# EAGLE design filters_V1.1_no_gnd_vias (EAGLE 7.4.0)
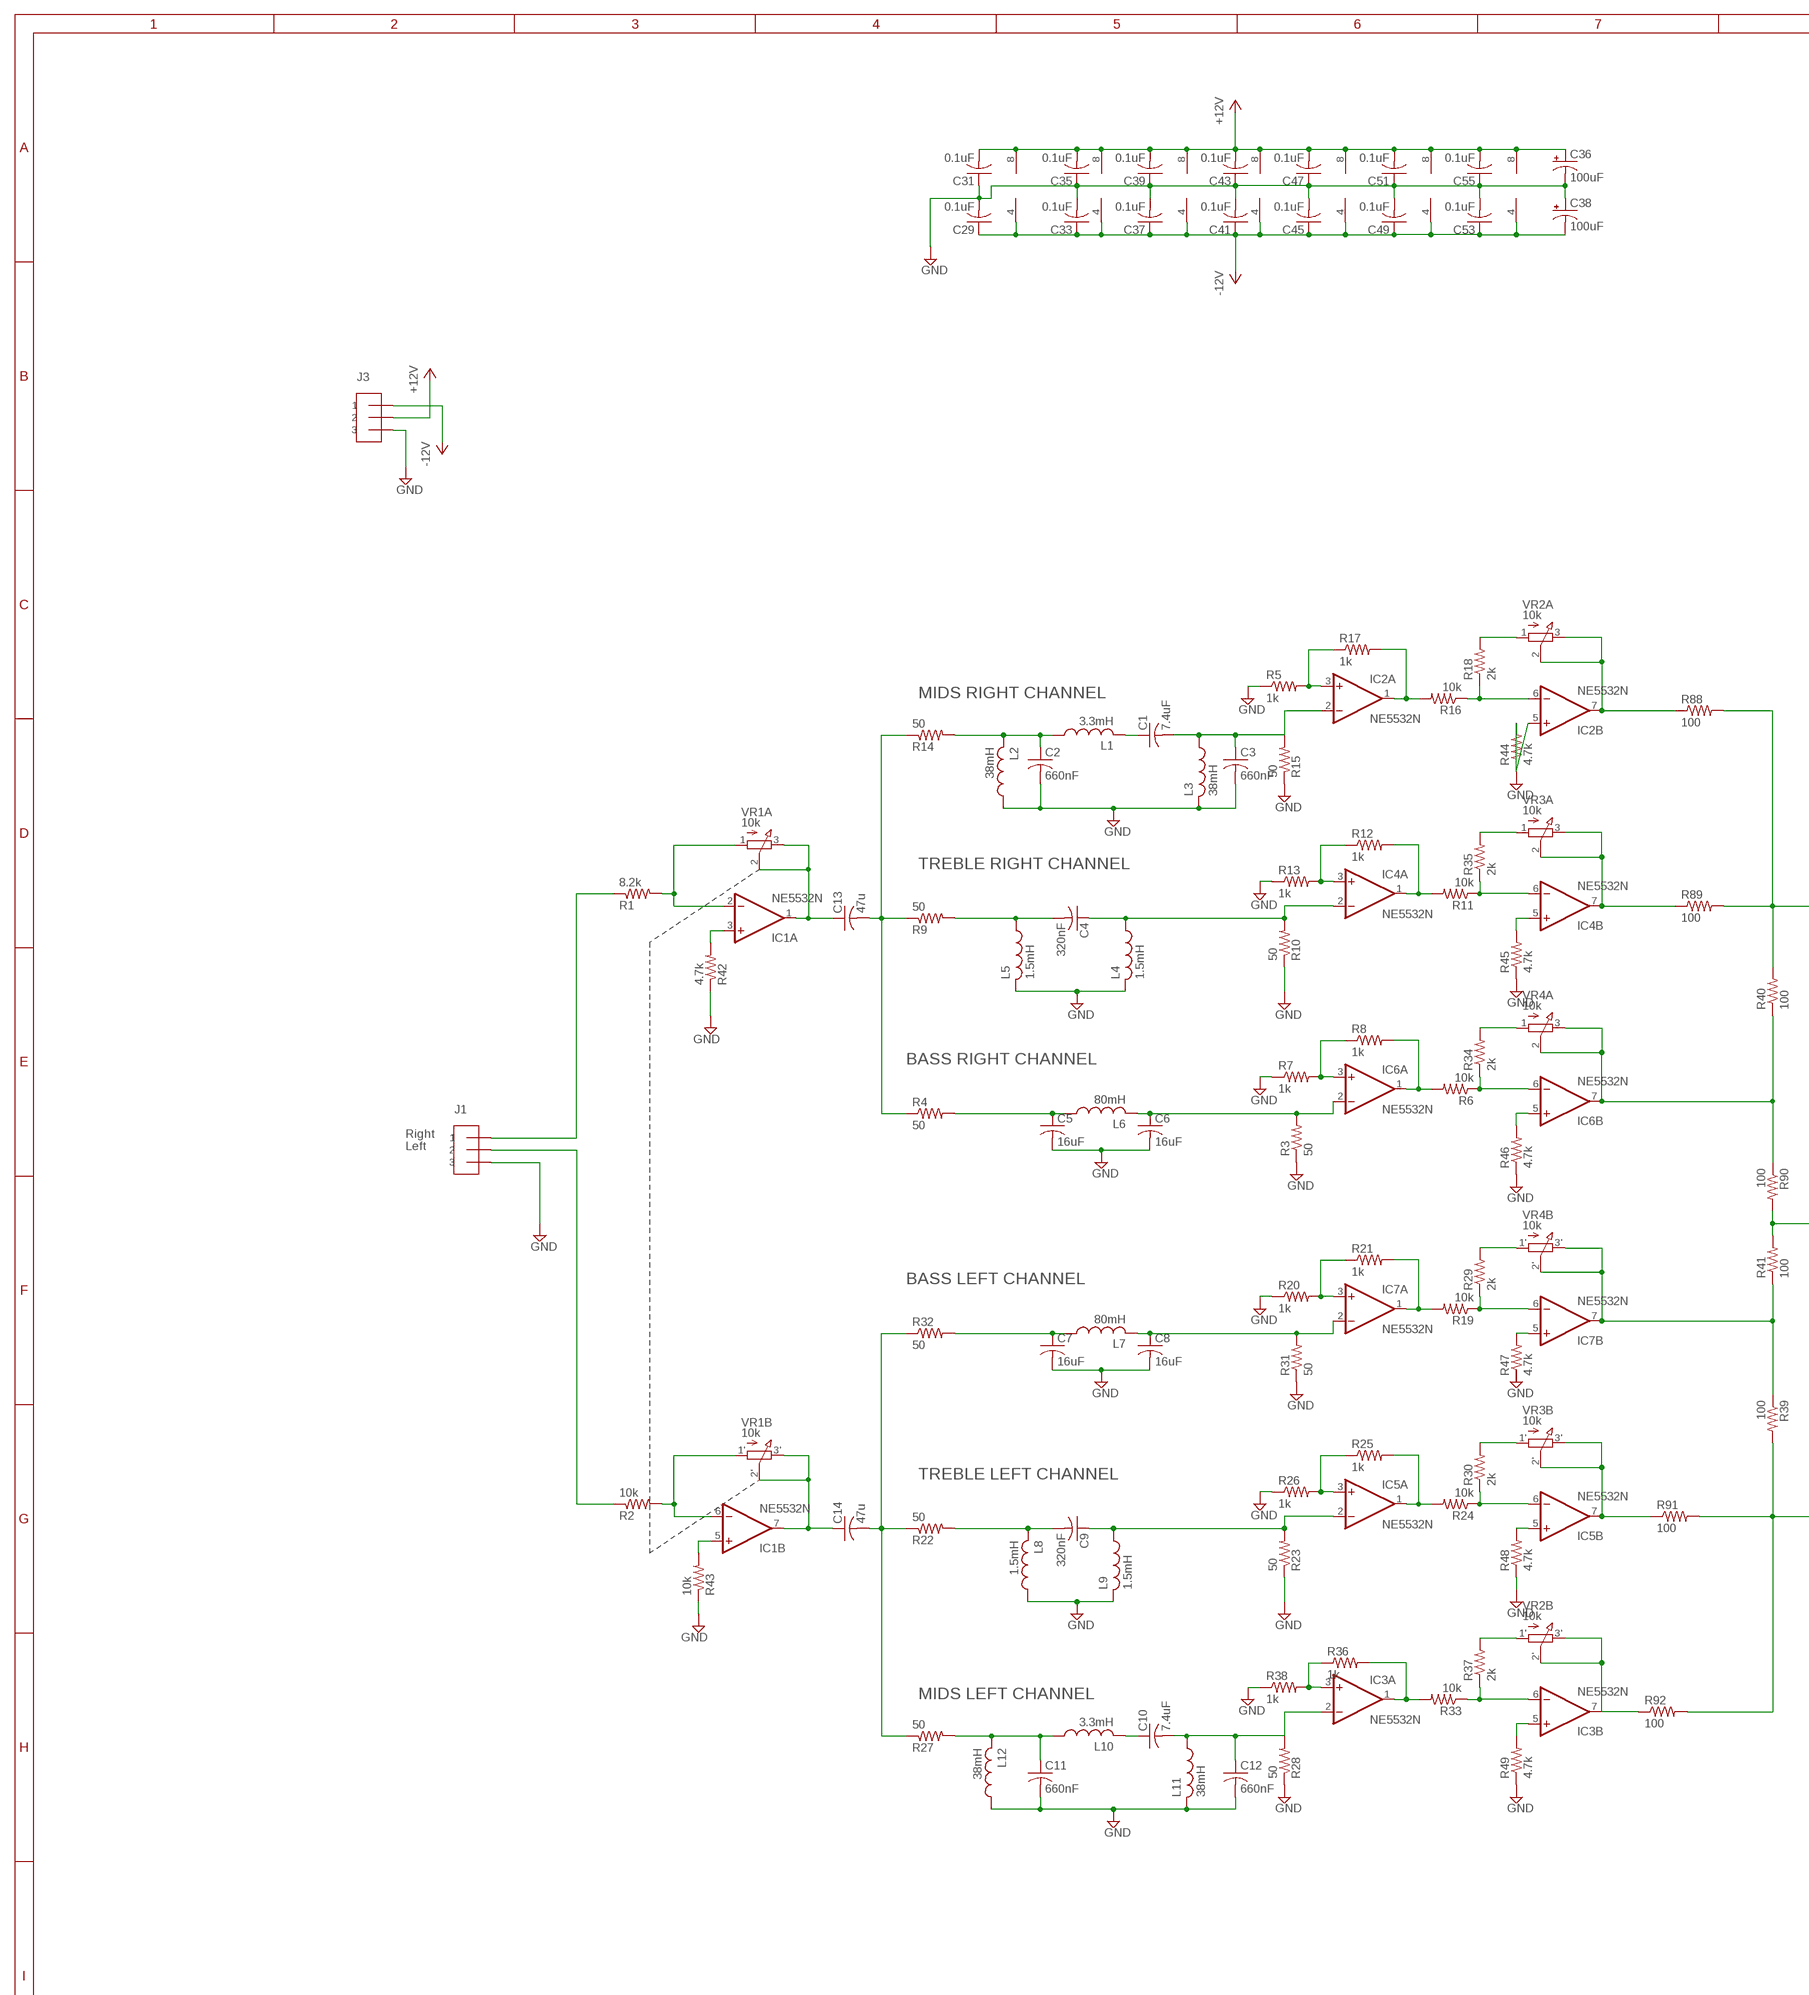
[diagram p0: schematic, sheet 1, part 1 of 2]
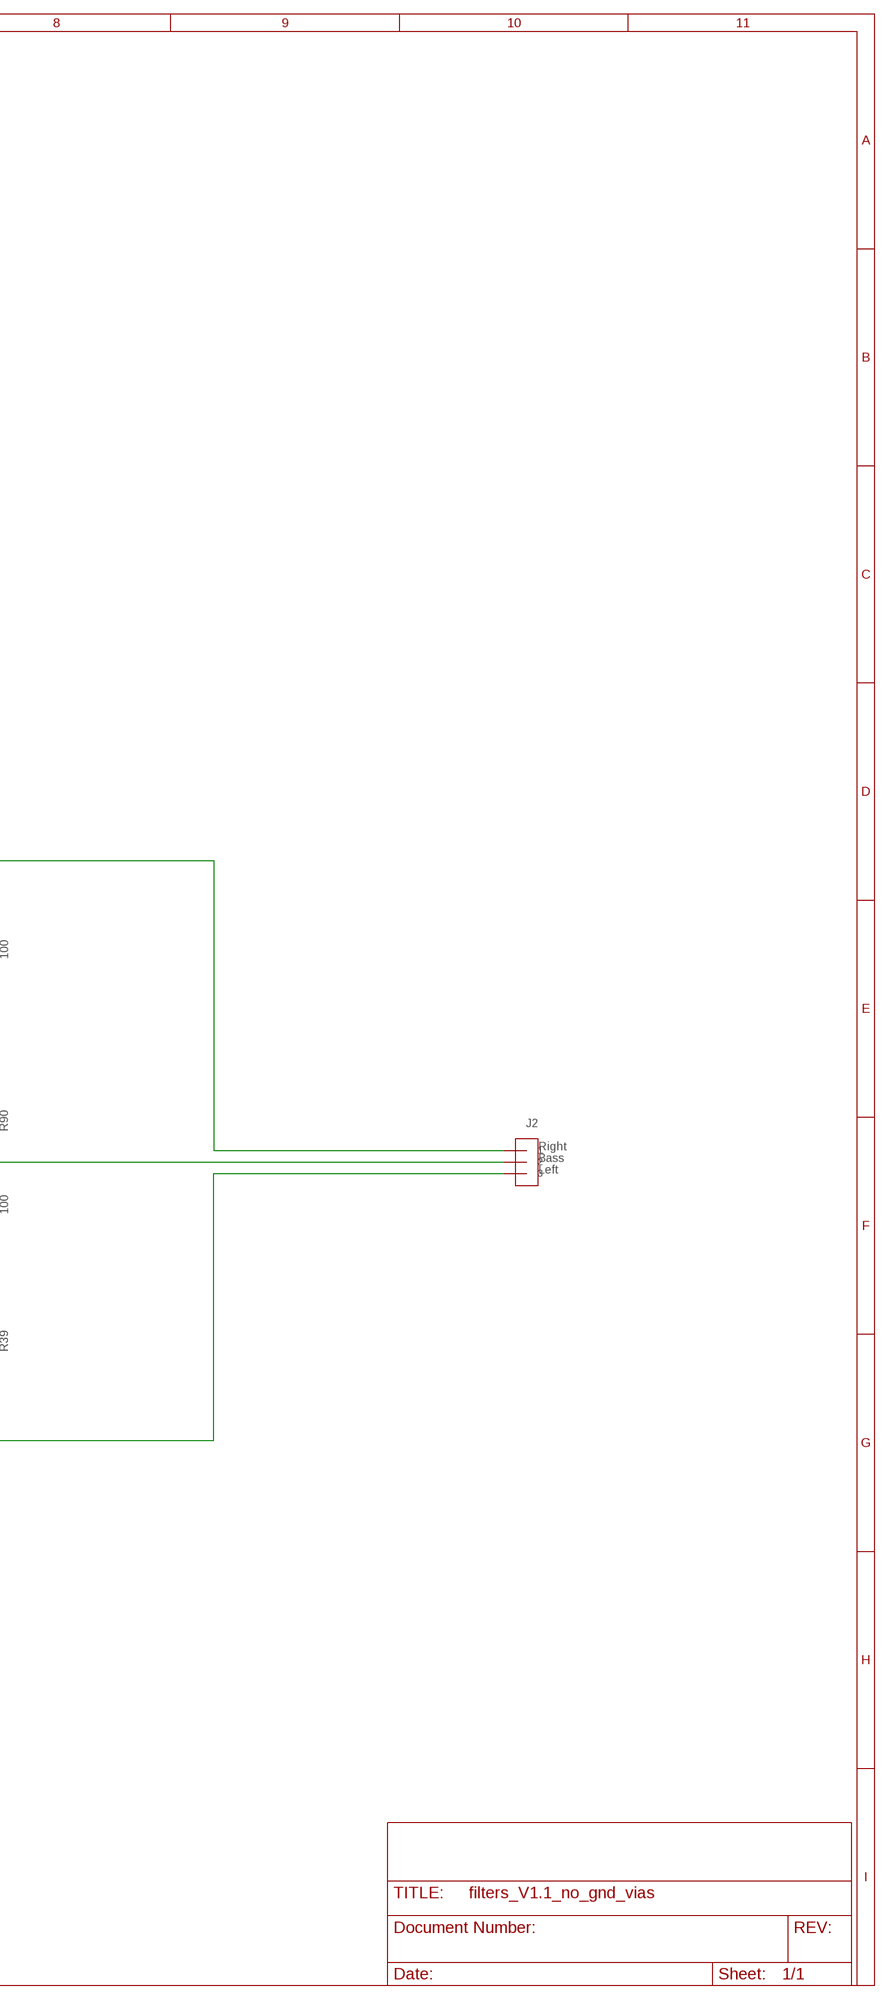
[diagram p1: schematic, sheet 1, part 2 of 2]

## Parts
C1  7.4uF  C-US050-024X044  [C050-024X044]
C2  660nF  C-US050-024X044  [C050-024X044]
C3  660nF  C-US050-024X044  [C050-024X044]
C4  320nF  C-US050-024X044  [C050-024X044]
C5  16uF  C-US050-024X044  [C050-024X044]
C6  16uF  C-US050-024X044  [C050-024X044]
C7  16uF  C-US050-024X044  [C050-024X044]
C8  16uF  C-US050-024X044  [C050-024X044]
C9  320nF  C-US050-024X044  [C050-024X044]
C10  7.4uF  C-US050-024X044  [C050-024X044]
C11  660nF  C-US050-024X044  [C050-024X044]
C12  660nF  C-US050-024X044  [C050-024X044]
C13  47u  C-US050-024X044  [C050-024X044]
C14  47u  C-US050-024X044  [C050-024X044]
C29  0.1uF  C-US050-024X044  [C050-024X044]
C31  0.1uF  C-US050-024X044  [C050-024X044]
C33  0.1uF  C-US050-024X044  [C050-024X044]
C35  0.1uF  C-US050-024X044  [C050-024X044]
C36  100uF  CPOL-USE2.5-6  [E2,5-6]
C37  0.1uF  C-US050-024X044  [C050-024X044]
C38  100uF  CPOL-USE2.5-6  [E2,5-6]
C39  0.1uF  C-US050-024X044  [C050-024X044]
C41  0.1uF  C-US050-024X044  [C050-024X044]
C43  0.1uF  C-US050-024X044  [C050-024X044]
C45  0.1uF  C-US050-024X044  [C050-024X044]
C47  0.1uF  C-US050-024X044  [C050-024X044]
C49  0.1uF  C-US050-024X044  [C050-024X044]
C51  0.1uF  C-US050-024X044  [C050-024X044]
C53  0.1uF  C-US050-024X044  [C050-024X044]
C55  0.1uF  C-US050-024X044  [C050-024X044]
IC1  NE5532N  [DIL08]
IC2  NE5532N  [DIL08]
IC3  NE5532N  [DIL08]
IC4  NE5532N  [DIL08]
IC5  NE5532N  [DIL08]
IC6  NE5532N  [DIL08]
IC7  NE5532N  [DIL08]
J1  3_PIN_AMPCONN  [3_PIN_AMPCONN]
J2  3_PIN_AMPCONN  [3_PIN_AMPCONN]
J3  3_PIN_AMPCONN  [3_PIN_AMPCONN]
L1  3.3mH  L-US6000-XXX-RC  [6000-XXXX-RC]
L2  38mH  L-US6000-XXX-RC  [6000-XXXX-RC]
L3  38mH  L-US6000-XXX-RC  [6000-XXXX-RC]
L4  1.5mH  L-US6000-XXX-RC  [6000-XXXX-RC]
L5  1.5mH  L-US6000-XXX-RC  [6000-XXXX-RC]
L6  80mH  L-US6000-XXX-RC  [6000-XXXX-RC]
L7  80mH  L-US6000-XXX-RC  [6000-XXXX-RC]
L8  1.5mH  L-US6000-XXX-RC  [6000-XXXX-RC]
L9  1.5mH  L-US6000-XXX-RC  [6000-XXXX-RC]
L10  3.3mH  L-US6000-XXX-RC  [6000-XXXX-RC]
L11  38mH  L-US6000-XXX-RC  [6000-XXXX-RC]
L12  38mH  L-US6000-XXX-RC  [6000-XXXX-RC]
R1  8.2k  R-US_0204/2V  [0204V]
R2  10k  R-US_0204/2V  [0204V]
R3  50  R-US_0204/2V  [0204V]
R4  50  R-US_0204/2V  [0204V]
R5  1k  R-US_0204/2V  [0204V]
R6  10k  R-US_0204/2V  [0204V]
R7  1k  R-US_0204/2V  [0204V]
R8  1k  R-US_0204/2V  [0204V]
R9  50  R-US_0204/2V  [0204V]
R10  50  R-US_0204/2V  [0204V]
R11  10k  R-US_0204/2V  [0204V]
R12  1k  R-US_0204/2V  [0204V]
R13  1k  R-US_0204/2V  [0204V]
R14  50  R-US_0204/2V  [0204V]
R15  50  R-US_0204/2V  [0204V]
R16  10k  R-US_0204/2V  [0204V]
R17  1k  R-US_0204/2V  [0204V]
R18  2k  R-US_0204/2V  [0204V]
R19  10k  R-US_0204/2V  [0204V]
R20  1k  R-US_0204/2V  [0204V]
R21  1k  R-US_0204/2V  [0204V]
R22  50  R-US_0204/2V  [0204V]
R23  50  R-US_0204/2V  [0204V]
R24  10k  R-US_0204/2V  [0204V]
R25  1k  R-US_0204/2V  [0204V]
R26  1k  R-US_0204/2V  [0204V]
R27  50  R-US_0204/2V  [0204V]
R28  50  R-US_0204/2V  [0204V]
R29  2k  R-US_0204/2V  [0204V]
R30  2k  R-US_0204/2V  [0204V]
R31  50  R-US_0204/2V  [0204V]
R32  50  R-US_0204/2V  [0204V]
R33  10k  R-US_0204/2V  [0204V]
R34  2k  R-US_0204/2V  [0204V]
R35  2k  R-US_0204/2V  [0204V]
R36  1k  R-US_0204/2V  [0204V]
R37  2k  R-US_0204/2V  [0204V]
R38  1k  R-US_0204/2V  [0204V]
R39  100  R-US_0204/2V  [0204V]
R40  100  R-US_0204/2V  [0204V]
R41  100  R-US_0204/2V  [0204V]
R42  4.7k  R-US_0204/2V  [0204V]
R43  10k  R-US_0204/2V  [0204V]
R44  4.7k  R-US_0204/2V  [0204V]
R45  4.7k  R-US_0204/2V  [0204V]
R46  4.7k  R-US_0204/2V  [0204V]
R47  4.7k  R-US_0204/2V  [0204V]
R48  4.7k  R-US_0204/2V  [0204V]
R49  4.7k  R-US_0204/2V  [0204V]
R88  100  R-US_0204/2V  [0204V]
R89  100  R-US_0204/2V  [0204V]
R90  100  R-US_0204/2V  [0204V]
R91  100  R-US_0204/2V  [0204V]
R92  100  R-US_0204/2V  [0204V]
VR1  10k  VOL_POT_2GANG  [VOL_POT_2GANG]
VR2  10k  P140KV1-F25BR  [TONE_POT_2GANG]
VR3  10k  P140KV1-F25BR  [TONE_POT_2GANG]
VR4  10k  P140KV1-F25BR  [TONE_POT_2GANG]

## Nets
+12V: C31.2 C35.2 C36.+ C39.2 C43.2 C47.2 C51.2 C55.2 IC1.8(P:V+) IC2.8(P:V+) IC3.8(P:V+) IC4.8(P:V+) IC5.8(P:V+) IC6.8(P:V+) IC7.8(P:V+) J3.2
-12V: C29.1 C33.1 C37.1 C38.- C41.1 C45.1 C49.1 C53.1 IC1.4(P:V-) IC2.4(P:V-) IC3.4(P:V-) IC4.4(P:V-) IC5.4(P:V-) IC6.4(P:V-) IC7.4(P:V-) J3.1
GND: C2.2 C3.2 C5.2 C6.2 C7.2 C8.2 C11.2 C12.2 C29.2 C31.1 C33.2 C35.1 C36.- C37.2 C38.+ C39.1 C41.2 C43.1 C45.2 C47.1 C49.2 C51.1 C53.2 C55.1 J1.3 J3.3 L2.1 L3.2 L4.2 L5.2 L8.1 L9.2 L11.2 L12.1 R3.1 R5.1 R7.1 R10.1 R13.1 R15.1 R20.1 R23.1 R26.1 R28.1 R31.1 R38.1 R42.1 R43.1 R44.2 R45.1 R46.1 R48.1 R49.1
MVO: IC6.7(B:OUT) R40.1 R90.1 VR4.2(A:1_2) VR4.3(A:1_3)
N$1: IC1.2(A:-IN) R1.2 VR1.1
N$2: C13.1 IC1.1(A:OUT) VR1.2 VR1.3
N$3: IC1.6(B:-IN) R2.2 VR1.1'
N$4: IC2.6(B:-IN) R16.1 R18.1
N$5: C14.1 IC1.7(B:OUT) VR1.2' VR1.3'
N$6: IC6.3(A:+IN) R7.2 R8.1
N$7: C6.1 IC6.2(A:-IN) L6.2 R3.2
N$8: IC3.6(B:-IN) R33.1 R37.1
N$9: IC4.3(A:+IN) R12.1 R13.2
N$10: J2.1 R40.2 R88.2 R89.2
N$11: IC6.6(B:-IN) R6.1 R34.1
N$12: C5.1 L6.1 R4.2
N$13: C4.2 L5.1 R9.2
N$14: C8.1 IC7.2(A:-IN) L7.2 R31.2
N$15: IC2.1(A:OUT) R16.2 R17.2
N$16: IC1.3(A:+IN) R42.2
N$17: IC4.1(A:OUT) R11.2 R12.2
N$18: IC4.6(B:-IN) R11.1 R35.1
N$19: J2.2 R41.2 R90.2
N$20: IC1.5(B:+IN) R43.2
N$21: IC2.7(B:OUT) R88.1 VR2.2(A:1_2) VR2.3(A:1_3)
N$22: C13.2 R4.1 R9.1 R14.1
N$23: C2.1 L1.1 L2.2 R14.2
N$24: R18.2 VR2.1(A:1_1)
N$25: IC7.6(B:-IN) R19.1 R29.1
N$26: J1.1 R1.1
N$27: IC2.3(A:+IN) R5.2 R17.1
N$28: IC2.5(B:+IN) R44.1
N$29: C1.1 L1.2
N$30: C9.2 L8.2 R22.2
N$31: IC5.5(B:+IN) R48.2
N$32: IC5.1(A:OUT) R24.2 R25.2
N$33: IC5.6(B:-IN) R24.1 R30.1
N$34: C11.1 L10.1 L12.2 R27.2
N$35: C10.1 L10.2
N$36: IC4.5(B:+IN) R45.2
N$37: R29.2 VR4.1'(B:1_1)
N$38: J2.3 R39.2 R91.2 R92.2
N$39: IC6.5(B:+IN) R46.2
N$40: IC7.7(B:OUT) R39.1 R41.1 VR4.2'(B:1_2) VR4.3'(B:1_3)
N$41: IC5.7(B:OUT) R91.1 VR3.2'(B:1_2) VR3.3'(B:1_3)
N$42: R30.2 VR3.1'(B:1_1)
N$43: IC7.1(A:OUT) R19.2 R21.2
N$44: C7.1 L7.1 R32.2
N$45: IC7.3(A:+IN) R20.2 R21.1
N$46: IC5.3(A:+IN) R25.1 R26.2
N$47: IC3.1(A:OUT) R33.2 R36.2
N$48: IC3.5(B:+IN) R49.2
N$49: IC7.5(B:+IN) R47.2
N$50: IC3.7(B:OUT) R92.1 VR2.2'(B:1_2) VR2.3'(B:1_3)
N$53: R34.2 VR4.1(A:1_1)
N$55: IC4.7(B:OUT) R89.1 VR3.2(A:1_2) VR3.3(A:1_3)
N$56: R35.2 VR3.1(A:1_1)
N$57: R37.2 VR2.1'(B:1_1)
N$58: IC3.3(A:+IN) R36.1 R38.2
N$59: C10.2 C12.1 IC3.2(A:-IN) L11.1 R28.2
N$60: C14.2 R22.1 R27.1 R32.1
N$61: C9.1 IC5.2(A:-IN) L9.1 R23.2
N$63: C4.1 IC4.2(A:-IN) L4.1 R10.2
N$88: IC6.1(A:OUT) R6.2 R8.2
N$104: C1.2 C3.1 IC2.2(A:-IN) L3.1 R15.2
N$108: J1.2 R2.1
Unconnected: R47.1

## Notes on the sheet
- MIDS RIGHT CHANNEL
- TREBLE RIGHT CHANNEL
- BASS RIGHT CHANNEL
- Right
- Left
- Right
- Bass
- Left
- BASS LEFT CHANNEL
- TREBLE LEFT CHANNEL
- MIDS LEFT CHANNEL

## Library data of the parts
C1-C14 C29 C31 C33 C35 C37 C39 C41 C43 C45 C47 C49 C51 C53 C55 = rcl:C-US: CAPACITOR, American symbol
C36 C38 = rcl:CPOL-US: POLARIZED CAPACITOR, American symbol
IC1-IC7 = linear:NE5532: AUDIO AMPLIFIER
J1-J3 = Amplifier_Parts:3_PIN_AMPCONN
L1-L12 = rcl:L-US: INDUCTOR, American symbol
R1-R49 R88-R92 = rcl:R-US_: RESISTOR, American symbol
VR1 = Amplifier_Parts:VOL_POT_2GANG
VR2-VR4 = Amplifier_Parts:P140KV1-F25BR

## Board
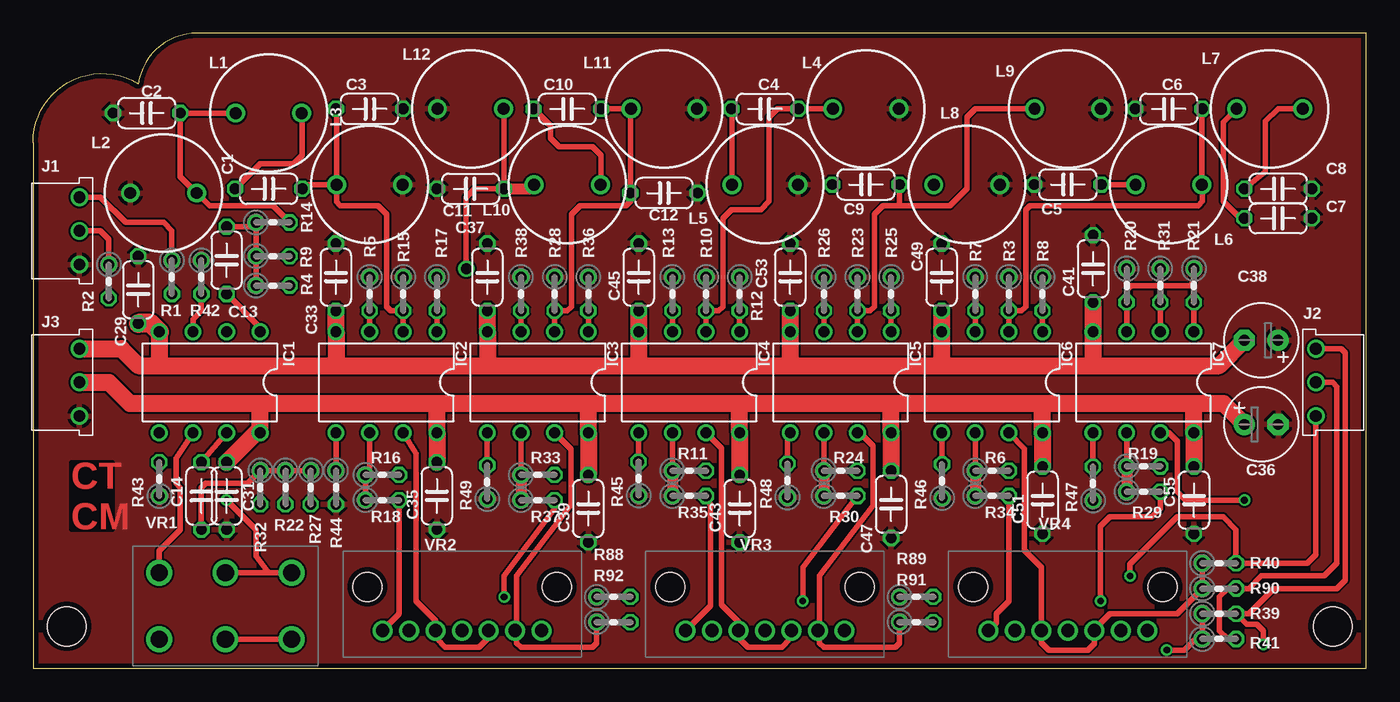
[diagram p2: board, top side]
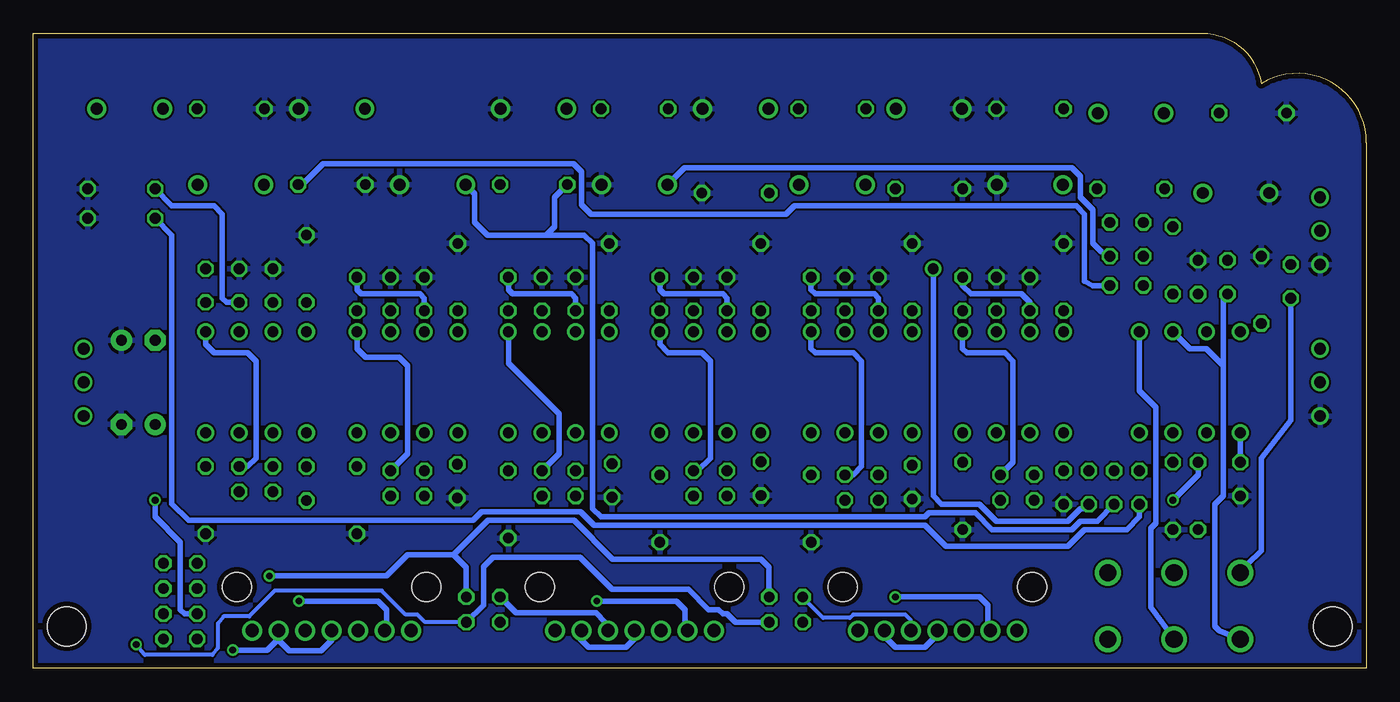
[diagram p3: board, bottom side, seen from below]

Size 100.65 x 47.94 mm. Coordinates in mm from the lower left corner, seen from the top.
Outline: 0,0 100.65,0 100.65,47.94 12.38,47.94 arc81 7.94,44.13 arc122 0,39.69 0,0
Copper layers (1*16): Top 0.0356mm / dielectric 1.5011mm / Bottom 0.0356mm
Design rules "OSH Park": minimum track width 6mil, minimum drill 13mil, track to track 6mil, track to pad 6mil, pad to pad 6mil, via to via 6mil, smd to smd 6mil, copper to edge 15mil, drill to drill 6mil, minimum pad ring 7mil, minimum via ring 7mil, stop-mask expansion 3mil, vias tented up to drill 0mil, thermal gap 10mil
Holes 2.95 mm at 2.54,3.17 98.11,3.17

### Footprints (pad centres in the part's own frame; a part is rotated, then mirrored left to right if it is on the bottom)
C050-024X044 = drill 0.813 octagon: 1 -2.54,0; 2 2.54,0
E2,5-6 = drill 0.813 pad 1.6: + -1.27,0 | drill 0.813 pad 1.6 octagon: - 1.27,0
DIL08 = drill 0.813 pad 1.27: 1 -3.81,-3.81; 2 -1.27,-3.81; 3 1.27,-3.81; 4 3.81,-3.81; 5 3.81,3.81; 6 1.27,3.81; 7 -1.27,3.81; 8 -3.81,3.81
3_PIN_AMPCONN = drill 0.89: 1 2.54,0; 2 0,0; 3 -2.54,0
6000-XXXX-RC = drill 0.9 pad 1.422: 1 -2.5,0; 2 2.5,0
0204V = drill 0.813 octagon: 1 -1.27,0; 2 1.27,0
VOL_POT_2GANG = drill 1.3: 1 -5,-2; 1' -5,3; 2 0,-2; 2' 0,3; 3 5,-2; 3' 5,3
TONE_POT_2GANG = drill 1: 1 -6,0; 1' -4,0; 2 -2,0; 2' 0,0; 3 2,0; 3' 4,0; NC 6,0 | hole 2.2: -7.15,3.3; 7.15,3.3

### Placement (x,y rotation side)
C1  17.78,36.2 0 top
C2  8.57,41.91 180 top
C3  25.4,42.23 0 top
C4  55.24,42.23 180 top
C5  78.11,36.51 180 top
C6  85.72,42.23 180 top
C7  93.98,33.97 0 top
C8  93.98,36.2 0 top
C9  62.87,36.51 180 top
C10  40.32,42.23 0 top
C11  33.02,36.2 180 top
C12  47.62,35.88 0 top
C13  14.61,30.8 90 top
C14  12.7,13.02 270 top
C29  7.94,28.57 90 top
C31  14.61,13.02 90 top
C33  22.86,29.53 90 top
C35  30.48,13.02 90 top
C36  92.71,18.41 0 top
C37  34.29,29.53 90 top
C38  92.71,24.77 180 top
C39  41.91,12.06 90 top
C41  80.01,30.16 90 top
C43  53.34,12.06 90 top
C45  45.72,29.53 90 top
C47  64.77,12.38 90 top
C49  68.58,29.53 90 top
C51  76.2,12.7 90 top
C53  57.15,29.53 90 top
C55  87.63,12.7 90 top
IC1  13.34,21.59 180 top
IC2  26.67,21.59 180 top
IC3  38.1,21.59 180 top
IC4  49.53,21.59 180 top
IC5  60.96,21.59 180 top
IC6  72.39,21.59 180 top
IC7  83.82,21.59 180 top
J1  3.49,33.02 90 top
J2  96.84,21.59 270 top
J3  3.49,21.59 90 top
L1  17.78,41.91 0 top
L2  9.84,35.88 0 top
L3  25.4,36.51 0 top
L4  62.87,42.23 0 top
L5  55.24,36.51 0 top
L6  85.72,36.51 0 top
L7  93.34,42.23 0 top
L8  70.48,36.51 180 top
L9  78.11,42.23 0 top
L10  40.32,36.51 0 top
L11  47.62,42.23 0 top
L12  33.02,42.23 0 top
R1  10.48,29.53 270 top
R2  5.71,29.21 270 top
R3  73.66,28.26 270 top
R4  18.1,28.89 0 top
R5  25.4,28.26 270 top
R6  72.39,14.92 0 top
R7  71.12,28.26 270 top
R8  76.2,28.26 270 top
R9  18.1,31.11 0 top
R10  50.8,28.26 270 top
R11  49.53,14.92 0 top
R12  53.34,28.26 270 top
R13  48.26,28.26 270 top
R14  18.1,33.66 0 top
R15  27.94,28.26 270 top
R16  26.35,14.61 0 top
R17  30.48,28.26 270 top
R18  26.35,12.7 0 top
R19  83.82,15.24 0 top
R20  82.55,28.89 270 top
R21  87.63,28.89 270 top
R22  19.05,13.65 270 top
R23  62.23,28.26 270 top
R24  60.96,14.92 0 top
R25  64.77,28.26 270 top
R26  59.69,28.26 270 top
R27  20.95,13.65 270 top
R28  39.37,28.26 270 top
R29  83.82,13.34 0 top
R30  60.96,13.02 0 top
R31  85.09,28.89 270 top
R32  17.14,13.65 270 top
R33  38.1,14.61 0 top
R34  72.39,13.02 0 top
R35  49.53,13.02 0 top
R36  41.91,28.26 270 top
R37  38.1,12.7 0 top
R38  36.83,28.26 270 top
R39  89.53,4.13 0 top
R40  89.53,7.94 0 top
R41  89.53,2.22 0 top
R42  12.7,29.53 270 top
R43  9.53,14.29 90 top
R44  22.86,13.65 270 top
R45  45.71,14.33 90 top
R46  68.62,14.14 90 top
R47  80.01,13.94 90 top
R48  56.95,14.19 90 top
R49  34.29,14.06 90 top
R88  43.81,5.4 0 top
R89  66.67,5.4 0 top
R90  89.53,6.03 0 top
R91  66.67,3.49 0 top
R92  43.81,3.49 0 top
VR1  14.51,4.21 0 top
VR2  32.38,2.86 0 top
VR3  55.24,2.86 0 top
VR4  78.11,2.86 0 top

### Tracks (layer width: path | path; a pad name or v marks a point on that pad's centre or on a via)
+12V
  Top 1.27: J3.2 5.71,21.59 7.3,20 16.83,20 | 16.83,20 30.48,20 | 30.48,20 41.59,20 | 41.59,20 53.34,20 | 53.34,20 64.77,20 | 64.77,20 76.2,20 | 76.2,20 87.95,20 | 87.95,20 89.85,20 C36.+ | 30.48,20 IC2.8 C35.2 | 41.59,20 41.91,19.68 IC3.8 C39.2 | 53.34,20 IC4.8 C43.2 | 76.2,20 IC6.8 C51.2 | 87.95,20 87.63,19.68 IC7.8 C55.2 | 16.83,20 17.14,19.68 IC1.8 16.83,17.78 C31.2 | 64.77,20 IC5.8 C47.2
-12V
  Top 1.27: J3.1 6.67,24.13 7.94,22.86 9.21,22.86 | 9.21,22.86 23.18,22.86 | 23.18,22.86 34.29,22.86 | 34.29,22.86 45.72,22.86 | 45.72,22.86 57.47,22.86 | 57.47,22.86 68.58,22.86 | 68.58,22.86 80.01,22.86 | 80.01,22.86 89.53,22.86 C38.- | 23.18,22.86 22.86,23.18 IC2.4 C33.1 | 34.29,22.86 IC3.4 C37.1 | 45.72,22.86 IC4.4 C45.1 | 57.47,22.86 57.15,23.18 IC5.4 C53.1 | 80.01,22.86 IC7.4 C41.1 | IC1.4 9.53,23.18 9.21,22.86 | 68.58,22.86 IC6.4 C49.1
  Top 1.422: IC1.4 8.89,26.04 C29.1
GND
  pour Top: 0,0 100.65,0 100.65,47.94 0,47.94
  pour Bottom: 0,0 100.97,-0.32 100.65,47.94 0,47.94
MVO
  Top 0.406: VR4.3 80.11,1.86 79.62,1.38 76.68,1.38 76.11,1.95 VR4.2 76.11,7.65 74.85,8.91 74.85,16.59 IC6.7 | VR4.3 | VR4.3 80.11,2.96 81.28,4.13 86.36,4.13 R90.1 R40.1
N$1
  Bottom 0.406: VR1.1 11.1,2.85 11.43,3.17 11.43,12.38 10.79,13.02 10.79,22.86 | 10.79,22.86 12.06,24.13 13.34,24.13 IC1.2 | R1.2 10.79,27.94 10.79,22.86
N$2
  Top 0.406: VR1.2 VR1.3 | C13.1 17.14,25.72 IC1.1
  Bottom 0.406: VR1.2 16.29,4.62 16.29,10.57 15.89,10.96 15.89,19.7 17.14,20.95 17.14,21.46 | 17.14,21.46 | IC1.1 17.14,21.46
N$3
  Top 0.406: IC1.6 10.79,15.88 10.79,13.97 11.11,13.65 11.11,10.48 9.51,8.88 VR1.1' 9.75,7.85
  Bottom 0.406: R2.2 5.71,18.73 7.94,15.88 7.94,8.89 8.98,7.85 VR1.1' 9.53,7.86
N$4
  Top 0.406: R18.1 R16.1 25.4,14.92 IC2.6
N$5  (via drill 0.51)
  Top 0.406: VR1.2' 17.78,7.21 | 17.78,7.21 VR1.3' | IC1.7 C14.1 | v14.61,12.7 16.83,10.48 16.83,8.48 17.78,7.21
  Bottom 0.406: C14.1 12.7,14.61 v14.61,12.7
N$6
  Top 0.406: R7.2 IC6.3
  Bottom 0.406: R7.2 71.12,27.94 71.44,28.26 75.88,28.26 76.2,28.57 R8.1
N$7
  Top 0.406: IC6.2 R3.2 74.61,26.99 74.93,27.3 74.93,34.61 75.25,34.92 87.95,34.92 88.27,35.24 88.27,36.51 L6.2 88.22,42.19 C6.1
N$8
  Top 0.406: IC3.6 R37.1
  Top 0.813: R33.1 R37.1
N$9
  Top 0.406: R13.2 IC4.3
  Bottom 0.406: R13.2 48.26,27.94 48.58,28.26 53.02,28.26 53.34,28.57 R12.1
N$10  (via drill 0.51)
  Top 0.406: J2.1 96.84,8.57 96.2,7.94 R40.2 90.81,10.48 89.85,11.43 86.36,11.43 82.8,7.87 v82.8,6.99
  Bottom 0.406: v82.8,6.99 73.98,6.99 72.39,8.57 68.9,8.57 | 68.9,8.57 67.94,7.62 R89.2 | 68.9,8.57 66.29,11.18 59.82,11.18 56.9,8.26 45.72,8.26 45.09,7.62 R88.2
N$11
  Top 0.406: IC6.6 R6.1
  Top 0.813: R6.1 R34.1
N$12
  Top 0.406: C5.1 L6.1
  Bottom 0.406: R4.2 20.64,28.89 21.27,29.21 21.27,34.29 21.91,34.92 43.18,34.92 43.81,34.29 58.52,34.29 59.23,35 59.23,37.47 59.87,38.1 78.74,38.1 80.33,36.51 C5.1
N$13
  Top 0.406: C4.2 52.74,41 L5.1
  Bottom 0.406: L5.1 51.48,37.78 22.23,37.78 21.59,37.15 21.59,35.56 20.64,34.61 20.64,32.07 20,31.43 R9.2
N$14
  Top 0.406: L7.2 93.98,42.23 93.03,41.27 93.03,37.47 C8.1 | R31.2 IC7.2
  Bottom 0.406: R31.2 86.04,27.62 86.36,27.94 86.36,34.29 87,34.92 90.17,34.92 C8.1
N$15
  Top 0.406: R17.2 IC2.1
  Bottom 0.406: IC2.1 30.48,24.13 30.16,23.81 27.3,23.81 26.67,23.18 26.67,15.56 R16.2
N$16
  Top 0.406: IC1.3 12.06,26.35 12.7,26.99 R42.2
N$17
  Top 0.406: R12.2 IC4.1
  Bottom 0.406: IC4.1 53.34,24.45 52.7,23.81 50.16,23.81 49.53,23.18 49.53,15.88 50.48,14.92 R11.2
N$18
  Top 0.406: R11.1 IC4.6
  Top 0.813: R11.1 R35.1
N$19
  Top 0.406: J2.2 98.11,21.59 98.42,21.27 98.42,7.94 97.47,6.99 92.71,6.99 91.76,6.03 R90.2 90.17,6.03 89.53,5.4 89.53,2.86 90.17,2.22 R41.2
N$20
  Bottom 0.406: IC1.5 R43.2
N$21
  Top 0.406: VR2.3 34.29,2.76 34.29,2.22 33.66,1.59 31.11,1.59 30.48,2.22 30.48,2.95 VR2.2 30.39,3.59 28.89,5.08 28.89,16.19 IC2.7
  Bottom 0.305: VR2.3 34.38,3.65 34.8,4.06 38.73,4.06 38.99,3.81 41.02,3.81 42.55,5.33
  Bottom 0.406: 42.55,5.33 R88.1
N$22
  Top 0.406: R4.1 R9.1 R14.1 16.51,33.34 C13.2
N$23
  Top 0.406: L1.1 C2.1 11.11,37.11 L2.2 13.31,34.91 18.12,34.91 R14.2
N$24
  Top 0.406: R18.2 27.62,4.13 26.39,2.89 VR2.1
N$25
  Top 0.406: IC7.6 R19.1
  Top 0.813: R19.1 R29.1
N$26
  Top 0.406: J1.1 5.08,35.56 6.99,33.66 9.84,33.66 10.48,33.02 R1.1
N$27
  Top 0.406: R5.2 IC2.3
  Bottom 0.406: R5.2 25.4,27.62 26.04,28.26 29.84,28.26 30.48,28.89 R17.1
N$28
  Top 0.406: R44.1 IC2.5
N$29
  Top 0.406: C1.1 17.14,38.1 19.68,38.1 20.32,38.73 20.32,41.87
  Top 0.813: 20.32,41.87 L1.2
N$30
  Bottom 0.406: R22.2 20.32,11.11 21.59,11.11 22.23,10.48 28.26,10.48 29.53,11.75 33.02,11.75 33.34,11.43 57.78,11.43 58.42,12.06 58.42,32.07 59.05,32.7 61.91,32.7 | L8.2 67.31,35.84 67.31,33.66 66.36,32.7 61.91,32.7 | C9.2 61.28,35.56 61.28,33.34 61.91,32.7
N$31
  Top 0.406: IC5.5 56.95,17.58 R48.2
N$32
  Top 0.406: R25.2 IC5.1
  Bottom 0.406: R24.2 60.96,16.19 60.96,19.21 64.77,23.02 IC5.1
N$33
  Top 0.406: IC5.6 R24.1
  Top 0.813: R24.1 R30.1
N$34  (via drill 0.81)
  Top 0.406: v32.7,30.16 32.7,35.56 33.34,36.2 C11.1 35.56,42.19 L12.2
  Top 0.813: C11.1 37.51,36.2 L10.1
  Bottom 0.406: R27.2 21.27,12.06 21.59,12.06 22.54,11.11 27.94,11.11 29.21,12.38 32.07,12.38 32.7,13.02 v32.7,30.16
N$35
  Top 0.406: L10.2 42.86,36.55 42.86,38.73 42.23,39.37 39.69,39.37 39.05,40.01 39.05,40.96 C10.1
N$36
  Top 0.406: IC4.5 45.71,17.77 R45.2
N$37  (via drill 0.51)
  Top 0.406: v80.58,5.08 80.58,10.73 81.28,11.43 84.45,11.43 85.09,12.06 R29.2
  Bottom 0.406: v80.58,5.08 74.61,5.08 73.98,4.45 73.98,2.98 VR4.1'
N$38  (via drill 0.51)
  Top 0.406: J2.3 98.74,24.13 99.06,23.81 99.06,6.67 98.42,6.03 93.66,6.03 91.76,4.13 R39.2 91.61,3.32 92.38,3.32 92.87,2.84 v92.87,1.8
  Bottom 0.305: v92.87,1.8 92.21,1.02 87.12,1.02 86.71,1.56 86.71,3.38 86.27,3.94 84.34,3.94 82.4,5.87 74.32,5.87 72.52,4.06 71.63,4.06 71.06,3.49 R91.2
  Bottom 0.406: R91.2 66.65,4.79 66.65,7.67 65.94,8.38 59.36,8.38 56.95,5.97 51.18,5.97 49.66,4.45 48.9,4.45 48.58,4.13 48.26,4.13 47.62,3.49 R92.2
N$39
  Top 0.406: IC6.5 68.62,17.74 R46.2
N$40  (via drill 0.51)
  Top 0.406: v85.58,1.39 85.59,1.38 86.92,1.38 87.77,2.22 R41.1 R39.1 | IC7.7 85.72,17.78 86.36,17.14 86.36,13.34 87,12.7 v91.44,12.7
  Bottom 0.406: VR4.2' 78.11,2.12 78.9,1.33 81.31,1.33 82.08,2.1 82.08,2.28 | 82.08,2.28 82.08,2.84 VR4.3' | v85.58,1.39 82.97,1.39 82.08,2.28 | v91.44,12.7 91.44,11.43 89.53,9.53 89.53,4.45 89.22,4.13 R39.1
N$41
  Top 0.406: 59.37,2.98 59.37,6.99 63.39,12.27 63.39,16.8 62.41,17.78 IC5.7 | 59.37,2.98 VR3.3' | 59.37,2.98 59.37,1.91 59.69,1.59 65.09,1.59 65.41,1.91 R91.1
  Bottom 0.406: VR3.2' 55.24,2.22 55.88,1.59 58.74,1.59 59.37,2.22 59.37,2.73 VR3.3'
N$42  (via drill 0.51)
  Top 0.406: v58.1,5.08 58.1,7.62 R30.2
  Bottom 0.406: v58.1,5.08 52.07,5.08 51.44,4.45 51.44,3.05 VR3.1'
N$43
  Top 0.406: R21.2 IC7.1
  Bottom 0.406: IC7.1 87.63,24.45 87,23.81 84.45,23.81 83.82,23.18 83.82,15.88 84.45,15.24 R19.2
N$44
  Top 0.406: L7.1 89.85,41.23 89.85,35.24 91.12,33.97 C7.1
  Bottom 0.406: R32.2 17.14,11.43 18.1,10.48 21.27,10.48 22.54,9.21 31.75,9.21 33.34,10.79 58.29,10.79 59.31,11.81 66.8,11.81 67.44,11.18 88.9,11.18 90.17,12.45 90.17,32.7 C7.1
N$45
  Top 0.406: IC7.3 R20.2 82.55,28.57 82.87,28.89 87.31,28.89 87.63,29.21 R21.1
N$46
  Top 0.406: R26.2 IC5.3
  Bottom 0.406: R26.2 59.69,27.94 60.01,28.26 64.45,28.26 64.77,28.57 R25.1
N$47
  Top 0.406: R36.2 IC3.1
  Bottom 0.406: IC3.1 41.91,24.13 41.59,23.81 38.73,23.81 38.1,23.18 38.1,15.24 38.73,14.61 R33.2
N$48
  Top 0.406: IC3.5 R49.2
N$49
  Top 0.406: IC7.5 R47.2
N$50
  Top 0.406: 36.51,2.98 36.51,6.99 40.62,12.37 40.62,16.53 IC3.7 | 36.51,2.98 VR2.3' | 36.51,2.98 36.51,1.91 36.83,1.59 42.23,1.59 42.55,1.91 R92.1
  Bottom 0.406: VR2.2' 32.38,2.54 33.34,1.59 35.56,1.59 36.2,2.22 36.2,2.67 VR2.3'
N$53
  Top 0.406: VR4.1 72.71,3.46 72.71,4.13 73.66,5.08 R34.2
N$55
  Top 0.406: VR3.3 57.15,2.76 57.15,2.22 56.52,1.59 53.98,1.59 53.24,2.32 VR3.2 53.24,3.52 51.97,4.8 51.97,16.61 IC4.7
  Bottom 0.406: VR3.3 57.47,3.08 57.47,3.49 58.17,4.19 61.34,4.19 64.2,4.19 R89.1
N$56
  Top 0.406: R35.2 50.48,13.02 51.12,12.38 51.12,4.73 VR3.1
N$57  (via drill 0.51)
  Top 0.406: v35.56,5.4 35.56,6.99 39.37,12.06 R37.2
  Bottom 0.406: v35.56,5.4 29.21,5.4 28.57,4.76 28.57,3.05 VR2.1'
N$58
  Top 0.406: R38.2 IC3.3
  Bottom 0.406: R36.1 41.91,28.57 41.59,28.26 37.15,28.26 36.83,27.94 R38.2
N$59
  Top 0.406: C10.2 L11.1 45.09,42.19 C12.1 45.09,35.24 44.77,34.92 41.27,34.92 40.64,34.29 40.64,27.3 40.32,26.99 R28.2 IC3.2
N$60
  Top 0.406: R22.1 R27.1 R32.1 16.19,13.97 13.02,13.97 12.7,13.65 C14.2
N$61
  Top 0.406: 65.41,34.92 64.14,34.92 63.5,34.29 63.5,27.3 63.18,26.99 R23.2 IC5.2 | 65.41,34.92 69.22,34.92 70.48,36.2 70.48,41.59 71.12,42.23 L9.1 | C9.1 65.41,34.92
N$63
  Top 0.406: L4.1 C4.1 56.2,42.23 55.56,41.59 55.56,35.24 54.93,34.61 52.7,34.61 52.07,33.97 52.07,27.3 51.75,26.99 R10.2 IC4.2
N$88
  Top 0.406: R8.2 IC6.1
  Bottom 0.406: IC6.1 76.2,24.13 75.56,23.5 73.03,23.5 72.39,22.86 72.39,16.19 R6.2
N$104
  Top 0.406: IC2.2 R15.2 26.99,26.99 26.67,27.3 26.67,34.29 26.04,34.92 23.18,34.92 22.9,35.2 L3.1 | L3.1 22.9,42.19 C3.1 | C1.2 20.64,36.51 L3.1
N$108
  Top 0.406: J1.2 5.08,33.02 5.71,32.38 R2.1

### Text on the board
Top: CT / CM